# Altium schematic sheet IMU_breakout.SchDoc
size 594 x 420 mm
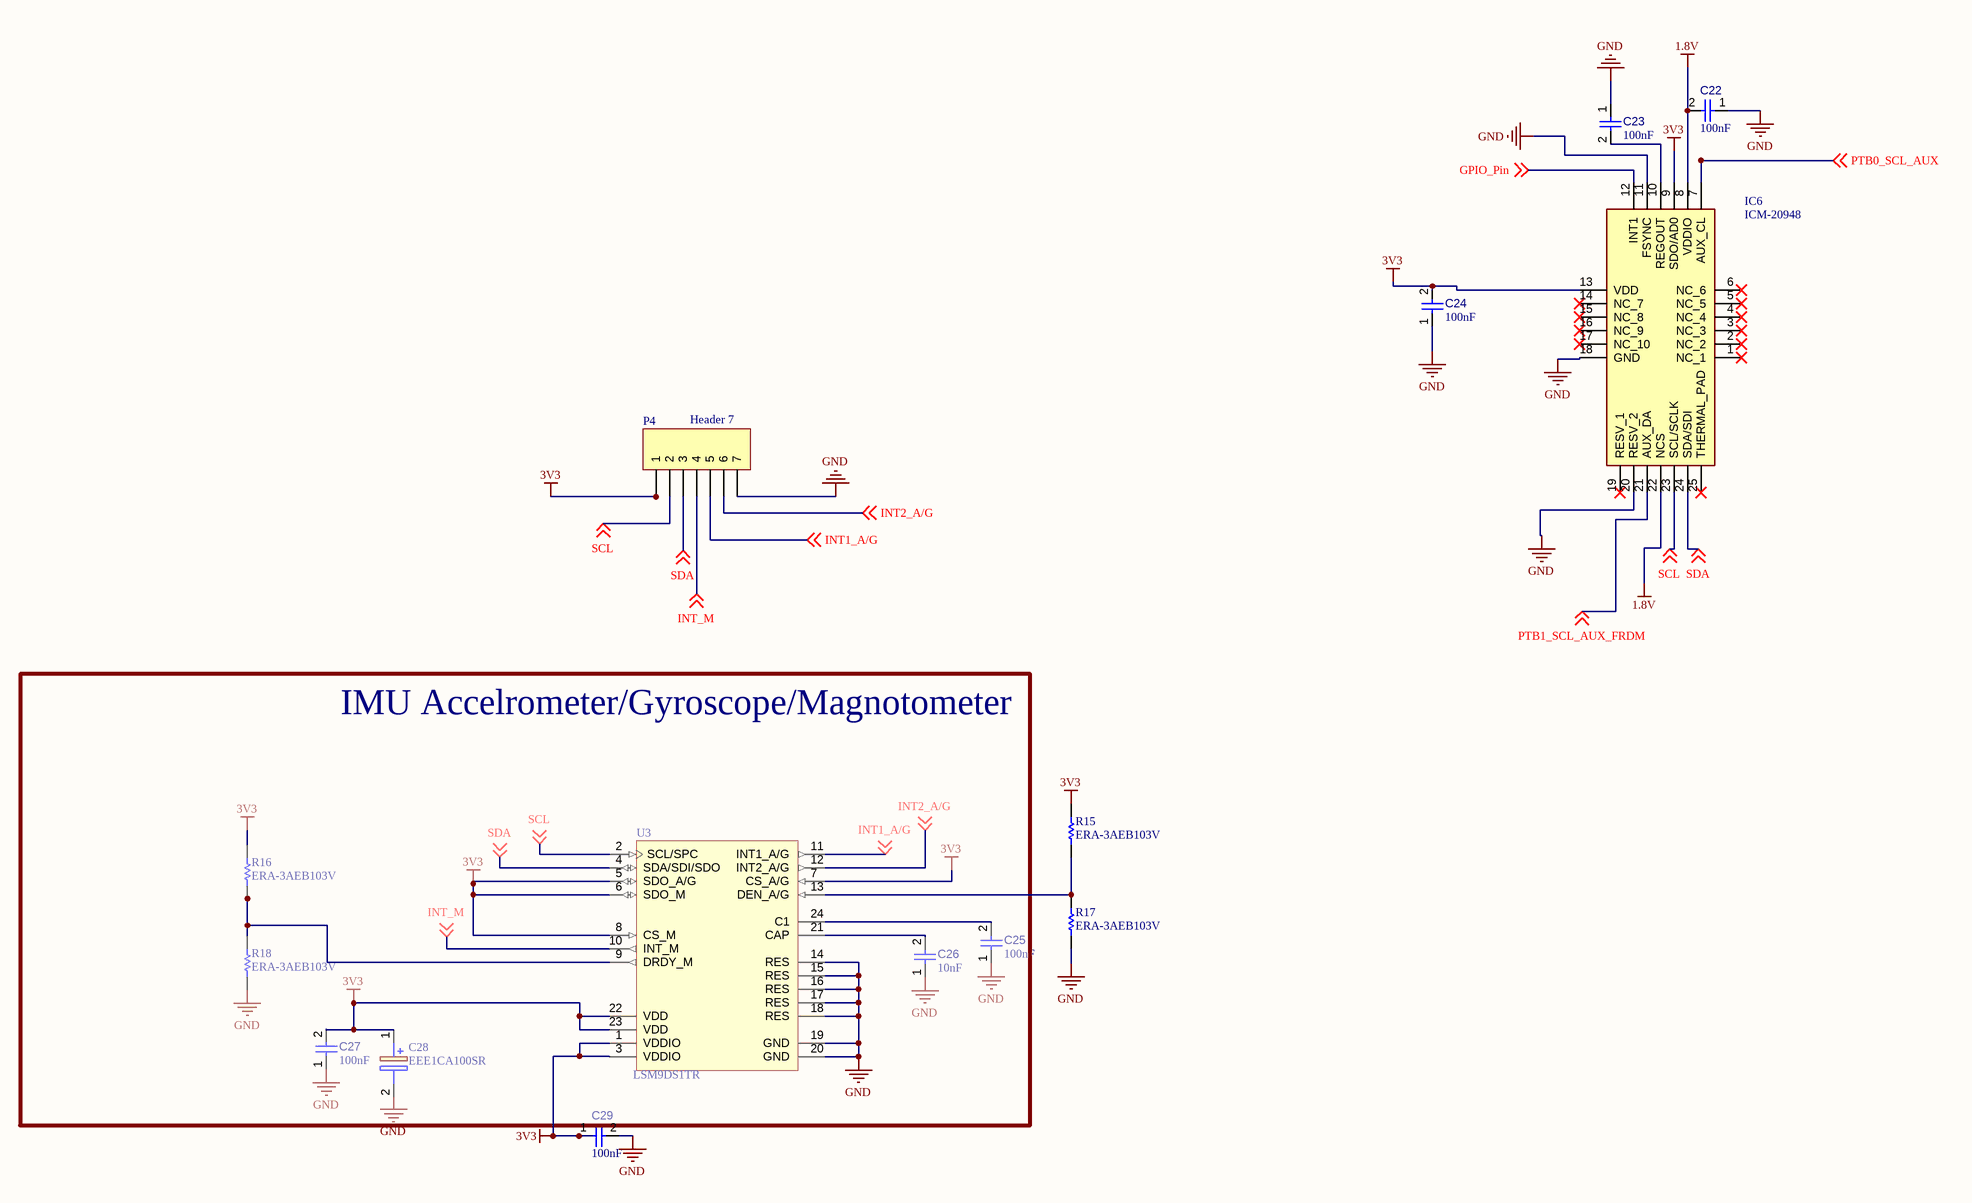
[diagram p0: IMU_breakout.SchDoc]

## Parts
C22  value 100nF  [CAPC1608X90X40ML10T20]  (hidden comment: Capacitor 100 nF +/-10% 50 V 0603)
C23  value 100nF  [CAPC1608X90X40ML10T20]  (hidden comment: Capacitor 100 nF +/-10% 50 V 0603)
C24  value 100nF  [CAPC1608X90X40ML10T20]  (hidden comment: Capacitor 100 nF +/-10% 50 V 0603)
C25  value 100nF  [CAPC1608X90X40ML10T20]  (hidden comment: Capacitor 100 nF +/-10% 50 V 0603)
C26  value 10nF  [CAPC0402(1005)60_L]  (hidden comment: Capacitor 10nF +/-20% 50V 0402)
C27  value 100nF  [CAPC1608X90X40ML10T20]  (hidden comment: Capacitor 100 nF +/-10% 50 V 0603)
C28  EEE1CA100SR  [CAPAE430X550N]
C29  value 100nF  [CAPC1608X90X40ML10T20]  (hidden comment: Capacitor 100 nF +/-10% 50 V 0603)
IC6  ICM-20948  [QFN40P300X300X105-25N-D]
P4  Header 7  [HDR1X7]
R15  ERA-3AEB103V  [RESC1608X55X30ML20T20]
R16  ERA-3AEB103V  [RESC1608X55X30ML20T20]
R17  ERA-3AEB103V  [RESC1608X55X30ML20T20]
R18  ERA-3AEB103V  [RESC1608X55X30ML20T20]
U3  LSM9DS1TR  [STM-LGA-24_3500X3000X1000]

## Blocks framed on the sheet
IMU Accelrometer/Gyroscope/Magnotometer: C25-C28 R16 R18 U3

## Nets
1.8V: C22.2 IC6.8(VDDIO) IC6.22(NCS)
3V3: C24.2 C27.2 C28.1(+) C29.1 IC6.9(SDO/AD0) IC6.13(VDD) P4.1 R15.2 R16.1 U3.1(VDDIO) U3.3(VDDIO) U3.5(SDO_A/G) U3.6(SDO_M) U3.7(CS_A/G) U3.8(CS_M) U3.22(VDD) U3.23(VDD)
GND: C22.1 C23.1 C24.1 C25.1 C26.1 C27.1 C29.2 IC6.11(FSYNC) IC6.18(GND) IC6.20(RESV_2) P4.7 R17.1 R18.2 U3.14(RES) U3.15(RES) U3.16(RES) U3.17(RES) U3.18(RES) U3.19(GND) U3.20(GND)
GPIO_Pin: IC6.12(INT1) ; off-sheet GPIO_Pin
INT1_A/G: P4.5 U3.11(INT1_A/G) ; off-sheet INT1_A/G
INT2_A/G: P4.6 U3.12(INT2_A/G) ; off-sheet INT2_A/G
INT_M: P4.4 U3.10(INT_M) ; off-sheet INT_M
PTB0_SCL_AUX: IC6.7(AUX_CL) ; off-sheet PTB0_SCL_AUX
PTB1_SCL_AUX_FRDM: IC6.21(AUX_DA) ; off-sheet PTB1_SCL_AUX_FRDM
SCL: IC6.23(SCL/SCLK) P4.2 U3.2(SCL/SPC) ; off-sheet SCL
SDA: IC6.24(SDA/SDI) P4.3 U3.4(SDA/SDI/SDO) ; off-sheet SDA
NetC23_2: C23.2 IC6.10(REGOUT)
NetC25_2: C25.2 U3.24(C1)
NetC26_2: C26.2 U3.21(CAP)
NetR15_1: R15.1 R17.2 U3.13(DEN_A/G)
NetR16_2: R16.2 R18.1 U3.9(DRDY_M)

Not connected (* = marked no-connect by the designer): C28 2(-); IC6 1(NC_1)* 2(NC_2)* 3(NC_3)* 4(NC_4)* 5(NC_5)* 6(NC_6)* 14(NC_7)* 15(NC_8)* 16(NC_9)* 17(NC_10)* 19(RESV_1)* 25(THERMAL_PAD)*

## Notes on the sheet
- Labels drawn without touching a wire or pin: GND
- 10
- 9
- 8
- 7
- 6
- 5
- 4
- 3
- DWG. NO.
- 2
- 1
- THIS DOCUMENT AND THE DATA DISCLOSED HEREIN OR HEREWITH IS THE PROPERTY OF ALTIUM LIMITED AND MAY BE FREELY DISTRIBUTED IN WHOLE. NO RIGHTS ARE RESERVED OR EXPRESS OR IMPLIED WARANTEE GIVEN.
- REV.
- SHT.
- REVISION
- DESCRIPTION
- DATE
- APPROVED
- H
- G
- F
- E
- D
- C
- B
- A
- TITLE
- SCALE:
- A2
- SIZE
- CAGE CODE
- FILE NAME
- DWG NO.
- SHEET
- OF
- REV

## Library data of the parts
C22-C25 C27 C29 = CMP-001-00017-4: Chip Capacitor, 100 nF, +/- 10%, 50 V, 0603 (1608 Metric); Capacitor Type: Ceramic; Voltage Rating: 50V; RoHS Compliant: True; Max Operating Temperature: 125°C; Pins: 2; Mounting Technology: SM; Min Operating Temperature: -55°C; Tolerance: 10%; Case/Package: 0603
C26 = CMP-001-00069-2: Chip Capacitor, 10nF +/-20%, 50V, 0402, Thickness 0.6 mm; Tolerance: 5%; Voltage Rating: 50V; Pins: 2; Max Operating Temperature: 85°C; Mounting Technology: SMT; Min Operating Temperature: -55°C; Case/Package: 0402
C28 = EEE1CA100SR: Capacitor Polarised; Manufacturer_Name: Panasonic; Datasheet Link: https://industrial.panasonic.com/cdbs/www-data/pdf/RDE0000/ABA0000C1145.pdf; Height: 5.5mm; Manufacturer_Part_Number: EEE1CA100SR; Arrow Part Number: EEE1CA100SR
IC6 = ICM-20948: Integrated Circuit; Manufacturer_Name: InvenSense Inc.; Datasheet Link: https://www.invensense.com/wp-content/uploads/2016/06/DS-000189-ICM-20948-v1.3.pdf; Height: 1.05mm; Manufacturer_Part_Number: ICM-20948; Arrow Part Number: ICM-20948; Arrow Price/Stock: https://www.arrow.com/en/products/icm-20948/invensense; Mouser Part Number: 410-ICM-20948; Mouser Price/Stock: https://www.mouser.co.uk/ProductDetail/TDK-InvenSense/ICM-20948?qs=u4fy%2FsgLU9OtGc31yF%2Friw%3D%3D
P4 = Header 7: Header, 7-Pin; LatestRevisionDate: 17-Jul-2002; LatestRevisionNote: Re-released for DXP Platform.; Publisher: Altium Limited
R15-R18 = CMP-2000-00874-1: Manufacturer: Panasonic; Part Number: ERA-3AEB103V
U3 = CMP-2000-06606-1: iNEMO Inertial Module: 3D Accelerometer, 3D Gyroscope, 3D Magnetometer, 1.9 to 3.6 V, -40 to 85 degC, 24-Pin LGA, RoHS, Tape and Reel; Manufacturer: STMicroelectronics; SVHC: NoSVHC(17-Dec-2015); MEMS Module Function: Tri-AxisGyroscope,Tri-AxisAccelerometer,Tri-AxisMagnetometer; Supply Voltage Max: 3.6V; No. of Pins: 24Pins; Gyroscope Range: ±245°/s,±500°/s,±2000°/s; Acceleration Range: ±2g,±4g,±8g,±16g; Supply Voltage Min: 1.9V; Package Description: 24-Pin Plastic Land Grid Array Package, Body 3.65 x 3.15 mm, Pitch 0.43 mm; Manufacturer URL: http://www.st.com/; PartNumber: LSM9DS1; Product Range: -; Packaging: CutTape; Sensor Case Style: LGA; Datasheet URL: http://www2.st.com/content/ccc/resource/technical/document/datasheet/1e/3f/2a/d6/25/eb/48/46/DM00103319.pdf/files/DM00103319.pdf/jcr:content/translations/en.DM00103319.pdf; Package Reference: LGA-24_3500X3000X1000; Mounting Technology: SurfaceMount; Datasheet Version: Rev. 3, 03/2015; MSL: MSL3-168hours